# EAGLE design DS2481-800-Test1 (EAGLE 7.3.0)
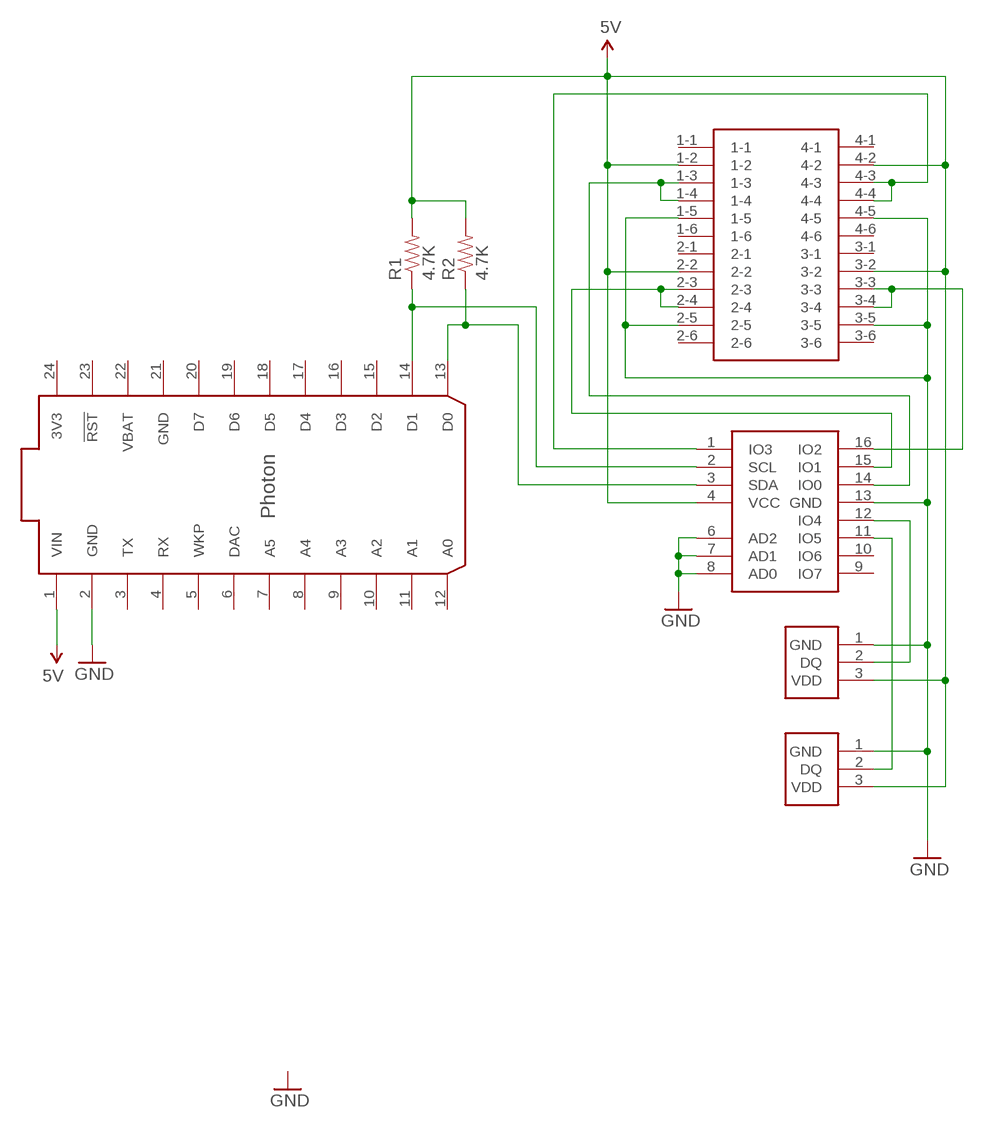
[diagram p0: schematic, sheet 1]

## Parts
R1  4.7K  RES-4.7K-0603  [0603-RES]
R2  4.7K  RES-4.7K-0603  [0603-RES]
U$1  PHOTON_WITH_HEADERS  [PHOTON]
U$2  DS2482-800  [16-SOIC-MAXIM]
U$3  MODULAR-JACK-6P6C-4  [MODULAR-JACK-6P6C-4]
U$4  TERMBLOCK-1WIRE  [TERMBLOCK-1WIRE]
U$5  TERMBLOCK-1WIRE  [TERMBLOCK-1WIRE]

## Nets
5V: R1.2 R2.2 U$1.1(VIN) U$2.4(VCC) U$3.1-2 U$3.2-2 U$3.3-2 U$3.4-2 U$4.3(VDD) U$5.3(VDD)
GND: U$1.2(GND) U$2.6(AD2) U$2.7(AD1) U$2.8(AD0) U$2.13(GND) U$3.1-5 U$3.2-5 U$3.3-5 U$3.4-5 U$4.1(GND) U$5.1(GND)
N$3: U$2.14(IO0) U$3.1-3 U$3.1-4
N$4: U$2.15(IO1) U$3.2-3 U$3.2-4
N$5: U$2.16(IO2) U$3.3-3 U$3.3-4
N$6: U$2.1(IO3) U$3.4-3 U$3.4-4
N$7: U$2.12(IO4) U$4.2(DQ)
N$8: U$2.11(IO5) U$5.2(DQ)
N$10: R2.1 U$1.13(D0) U$2.3(SDA)
N$11: R1.1 U$1.14(D1) U$2.2(SCL)
Unconnected: U$1.3(TX) U$1.4(RX) U$1.5(WKP) U$1.6(DAC) U$1.7(A5) U$1.8(A4) U$1.9(A3) U$1.10(A2) U$1.11(A1) U$1.12(A0) U$1.15(D2) U$1.16(D3) U$1.17(D4) U$1.18(D5) U$1.19(D6) U$1.20(D7) U$1.23(!RST) U$2.9(IO7) U$2.10(IO6) U$3.1-1 U$3.1-6 U$3.2-1 U$3.2-6 U$3.3-1 U$3.3-6 U$3.4-1 U$3.4-6

## Power pins joined to a net without a drawn wire
3V3: U$1.24(3V3)
GND: U$1.21(GND)
VBAT: U$1.22(VBAT)

## Library data of the parts
R1 R2 = rickk2:RES-4.7K-0603: RES SMD 4.7K OHM 5% 1/4W 0603 $ 0.11 https://www.digikey.com/product-detail/en/panasonic-electronic-components/ERJ-PA3J472V/P4.7KBZCT-ND/5036332 Panasonic
U$1 = rickk2:PHOTON: PPTC121LFBN-RC $ 0.98 Description CONN HEADER FEM 12POS.1" SGL TIN Expanded Description 12 Position Header Connector 0.100" (2.54mm) Through Hole Tin Digikey: S6100-ND Sullins: PPTC121LFBN-RC https://www.digikey.com/product-detail/en/sullins-connector-solutions/PPTC121LFBN-RC/S6100-ND/807231 SMD version $ 1.69 12 Position Header, Top or Bottom Entry Connector 0.100" (2.54mm) Surface Mount Tin Digikey: S5604-ND Sullins: NPTC121KFXC-RC Nylon/Phosphor Bronze / Tin / 0.1” / 12 Pos / 1 Row / Single Row SMT / SMT Single Row Pin 1 Left / ROHS Compliant https://www.digikey.com/product-detail/en/sullins-connector-solutions/NPTC121KFXC-RC/S5604-ND/776062
U$2 = rickk2:DS2482-800: IC I2C TO 1WIRE BRIDGE 16SOIC $7.70 1-Wire® Bridge, 1-Wire® to I²C I²C Interface, 8-channel 16-SO https://www.digikey.com/product-detail/en/maxim-integrated/DS2482S-800-/DS2482S-800--ND/1197437
U$3 = rickk2:MODULAR-JACK-6P6C-4: CONN MOD JACK 6P6C R/A UNSHLD $ 4.03 Stewart Connector SS-666604-NF Jack Modular Connector 6p6c (RJ11, RJ12, RJ14, RJ25) 90° Angle (Right) Unshielded Cat5 https://www.digikey.com/product-detail/en/stewart-connector/SS-666604-NF/380-1032-ND/388294
U$4 U$5 = rickk2:TERMBLOCK-1WIRE: TERM BLOCK 3.5MM VERT 3POS PCB $1.00 3 Position Wire to Board Terminal Block Horizontal with Board 0.138" (3.50mm) Through Hole 10A 16-26 AWG Top screw, vertical, blue https://www.digikey.com/product-detail/en/on-shore-technology-inc/OSTTE030161/ED2636-ND/614585

## Board
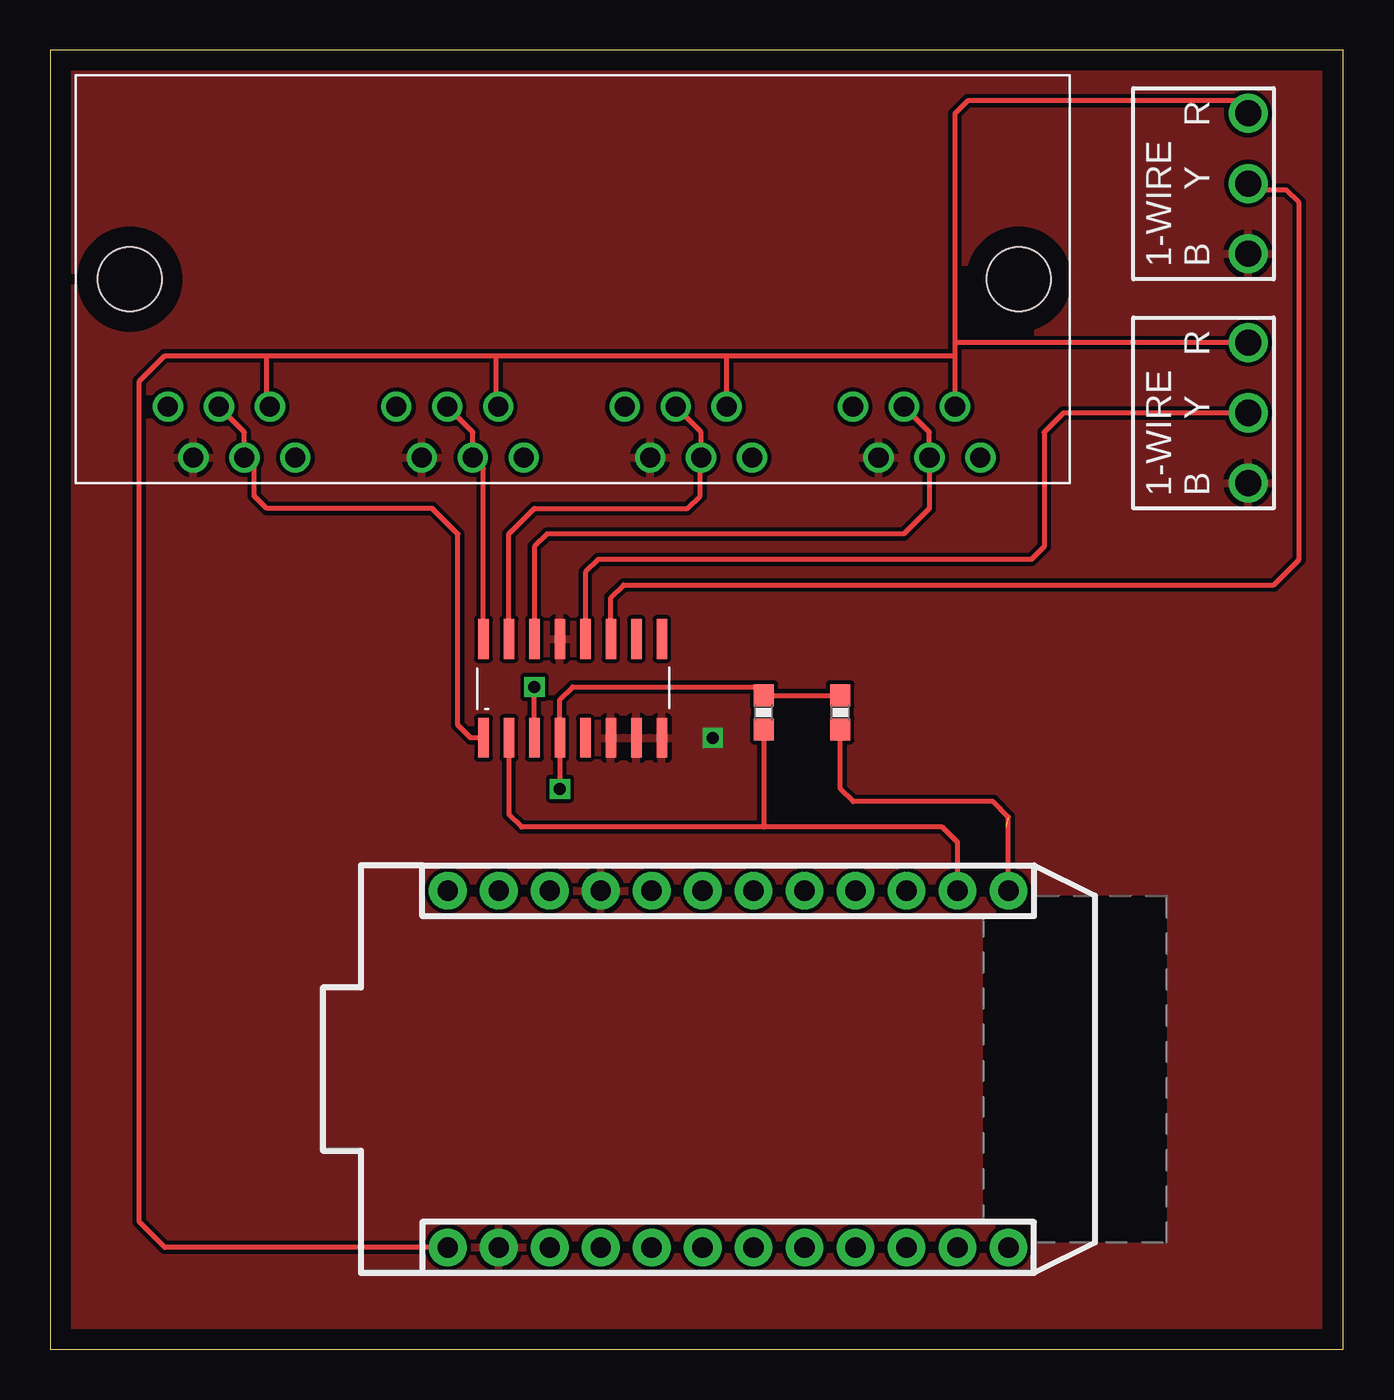
[diagram p1: board, top side]
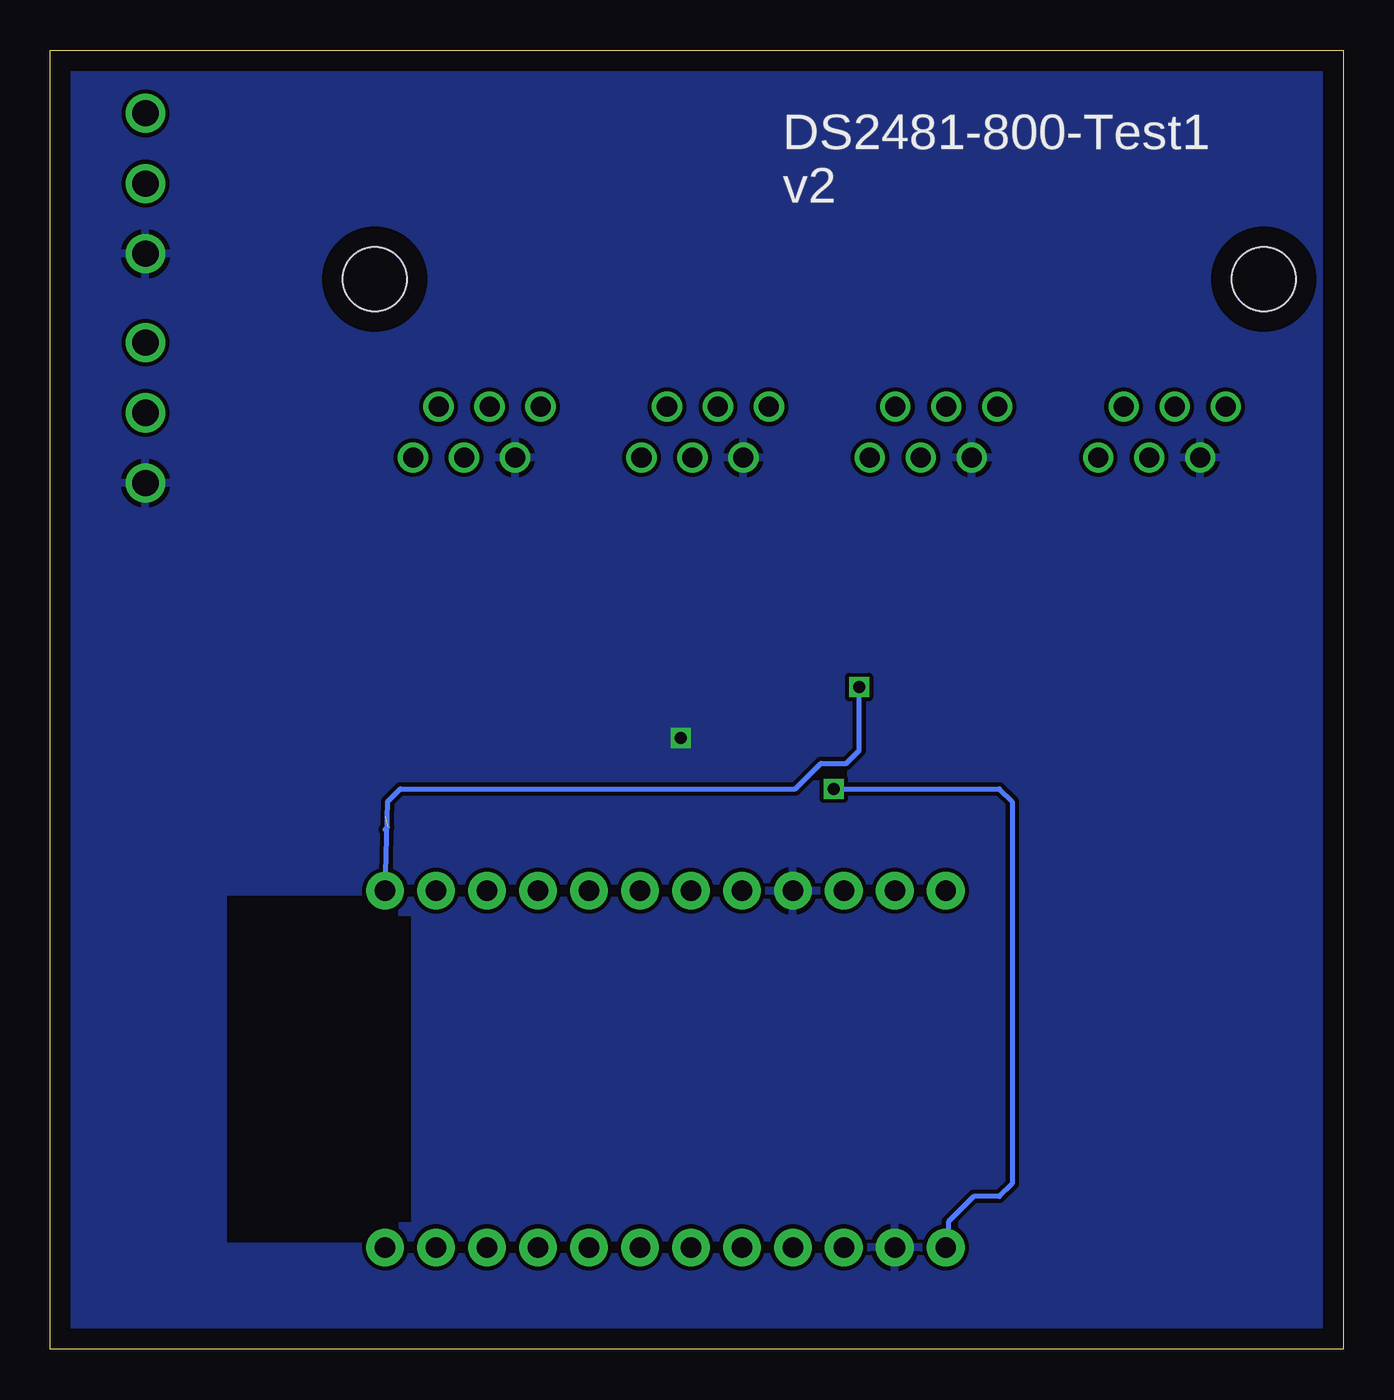
[diagram p2: board, bottom side, seen from below]

Size 64.44 x 64.76 mm. Coordinates in mm from the lower left corner, seen from the top.
Outline: 0,0 64.44,0 64.44,64.76 0,64.76 0,0
Copper layers (1*16): Top 0.035mm / dielectric 1.5mm / Bottom 0.035mm
Design rules "default": minimum track width 10mil, minimum drill 24mil, track to track 8mil, track to pad 8mil, pad to pad 8mil, via to via 8mil, smd to smd 8mil, copper to edge 40mil, drill to drill 8mil, minimum pad ring 10mil, minimum via ring 8mil, stop-mask expansion 4mil, vias tented up to drill 0mil, thermal gap 10mil

### Footprints (pad centres in the part's own frame; a part is rotated, then mirrored left to right if it is on the bottom)
0603-RES = smd 1.1 x 1: 1 -0.85,0; 2 0.85,0
PHOTON = drill 1.016 pad 1.88: 1 1.27,32.258; 2 1.27,29.718; 3 1.27,27.178; 4 1.27,24.638; 5 1.27,22.098; 6 1.27,19.558; 7 1.27,17.018; 8 1.27,14.478; 9 1.27,11.938; 10 1.27,9.398; 11 1.27,6.858; 12 1.27,4.318; 13 19.05,4.318; 14 19.05,6.858; 15 19.05,9.398; 16 19.05,11.938; 17 19.05,14.478; 18 19.05,17.018; 19 19.05,19.558; 20 19.05,22.098; 21 19.05,24.638; 22 19.05,27.178; 23 19.05,29.718; 24 19.05,32.258
16-SOIC-MAXIM = smd 0.53 x 1.98: 1 0,0; 2 1.27,0; 3 2.54,0; 4 3.81,0; 5 5.08,0; 6 6.35,0; 7 7.62,0; 8 8.89,0; 9 8.89,4.93; 10 7.62,4.93; 11 6.35,4.93; 12 5.08,4.93; 13 3.81,4.93; 14 2.54,4.93; 15 1.27,4.93; 16 0,4.93
MODULAR-JACK-6P6C-4 = drill 1: 1-1 1.905,8.89; 1-2 3.175,6.35; 1-3 4.445,8.89; 1-4 5.715,6.35; 1-5 6.985,8.89; 1-6 8.255,6.35; 2-1 13.284,8.89; 2-2 14.554,6.35; 2-3 15.824,8.89; 2-4 17.094,6.35; 2-5 18.364,8.89; 2-6 19.634,6.35; 3-1 24.663,8.89; 3-2 25.933,6.35; 3-3 27.203,8.89; 3-4 28.473,6.35; 3-5 29.743,8.89; 3-6 31.013,6.35; 4-1 36.043,8.89; 4-2 37.313,6.35; 4-3 38.583,8.89; 4-4 39.853,6.35; 4-5 41.123,8.89; 4-6 42.393,6.35 | hole 3.2: 0,0; 44.298,0
TERMBLOCK-1WIRE = drill 1.3: 1 0,0; 2 3.5,0; 3 7,0

### Placement (x,y rotation side)
R1  35.56,31.75 90 top
R2  39.37,31.75 90 top
U$1  52.07,3.81 90 top
U$2  21.59,30.48 0 top
U$3  48.26,53.34 180 top
U$4  59.69,43.18 90 top
U$5  59.69,54.61 90 top

### Tracks (layer width: path | path; a pad name or v marks a point on that pad's centre or on a via)
5V  (via drill 0.6)
  Top 0.254: U$3.4-2 10.79,46.99 10.79,49.53 | 10.79,49.53 22.23,49.53 | 22.23,49.53 33.66,49.53 | 33.66,49.53 45.09,49.53 | 45.09,49.53 U$3.1-2 | U$3.2-2 33.71,49.48 33.66,49.53 | U$3.3-2 22.23,46.99 22.23,49.53 | U$5.3 59.69,62.23 45.72,62.23 45.09,61.59 45.09,50.16 | 45.09,50.16 45.09,49.53 | U$4.3 45.1,50.18 45.09,50.16 | R2.2 R1.2 35.14,33.02 26.04,33.02 25.4,32.38 U$2.4 v25.4,27.94 | U$1.1 5.71,5.08 4.45,6.35 4.45,48.26 5.71,49.53 10.79,49.53
  Bottom 0.254: v25.4,27.94 17.14,27.94 16.51,27.3 16.51,8.26 17.14,7.62 18.41,7.62 19.68,6.35 19.68,5.21 U$1.1
GND  (via drill 0.6)
  other vias: 33.02,30.48
  pour Bottom: 0,0 0,64.77 64.77,64.77 64.77,0
  pour Top: 0,64.77 64.77,64.77 64.77,0 0,0
N$3
  Top 0.254: U$2.14 24.13,40.01 24.77,40.64 42.55,40.64 43.81,41.91 U$3.1-3 43.81,45.72 U$3.1-4
N$4
  Top 0.254: U$2.15 22.86,40.64 24.13,41.91 31.75,41.91 32.38,42.55 32.38,44.4 U$3.2-3 32.44,45.72 U$3.2-4
N$5
  Top 0.254: U$2.16 21.59,43.92 U$3.3-3 21.06,45.72 U$3.3-4
N$6
  Top 0.254: U$2.1 20.95,30.48 20.32,31.11 20.32,40.64 19.05,41.91 10.79,41.91 10.16,42.55 10.16,43.97 U$3.4-3 9.68,45.72 U$3.4-4
N$7
  Top 0.254: U$4.2 50.49,46.68 49.53,45.72 49.53,40.01 48.9,39.37 27.3,39.37 26.67,38.73 U$2.12
N$8
  Top 0.254: U$2.11 27.94,37.47 28.57,38.1 60.96,38.1 62.23,39.37 62.23,57.15 61.59,57.78 60.02,57.78 U$5.2
N$10  (via drill 0.6)  (1 unrouted)
  Top 0.254: U$1.13 47.75,26.54 46.99,27.3 40.01,27.3 39.37,27.94 R2.1 | U$2.3 v24.13,33.02
  Bottom 0.254: 47.75,25.91 47.62,26.04 | v24.13,33.02 24.13,29.84 24.77,29.21 26.04,29.21 27.3,27.94 46.99,27.94 47.62,27.3 U$1.13
N$11
  Top 0.254: U$1.14 45.21,25.27 44.45,26.04 35.56,26.04 | U$2.2 22.86,26.67 23.5,26.04 35.56,26.04 | R1.1 35.56,26.04

### Text on the board
bPlace: DS2481-800-Test1 / v2